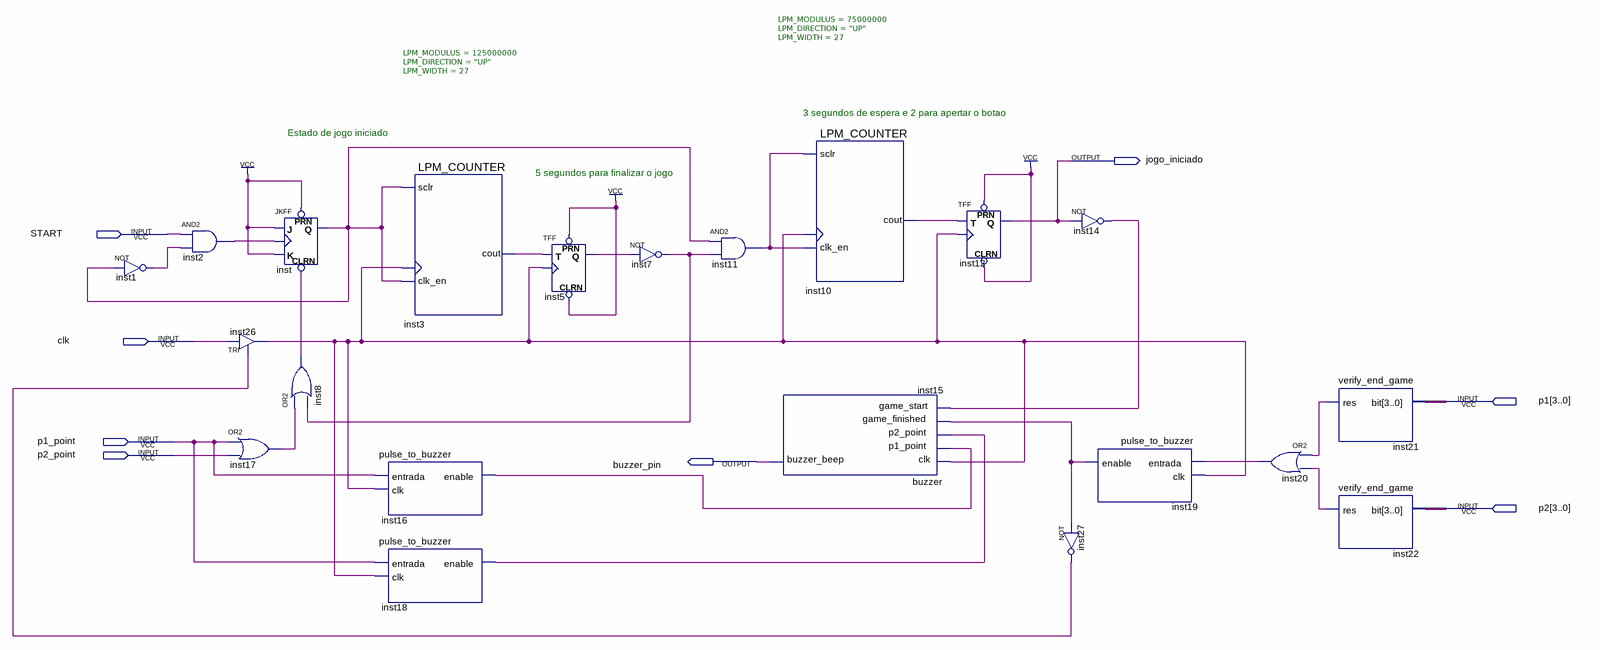
[diagram p0: schematic sheet]
// Quartus schematic game_control.bdf as structural Verilog: 21 symbols, 8 pins
module game_control (
  input  START,
  input  clk,
  input  [3:0] p1,
  input  p1_point,
  input  p2_point,
  input  [3:0] p2,
  output jogo_iniciado,
  output buzzer_pin
);

  wire inst1_out, inst2_out, inst3_cout, inst5_q, inst7_out, inst8_out, inst10_cout, inst11_out, inst14_out,
       inst16_enable, inst17_out, inst18_enable, inst19_enable, inst20_out, inst21_res, inst22_res,
       inst26_out, inst27_out, inst_q;

  not inst1 (inst1_out, inst_q);
  and inst2 (inst2_out, START, inst1_out);
  TRI inst26 (.IN(clk), .OE(inst27_out), .OUT(inst26_out));
  or inst17 (inst17_out, p1_point, p2_point);
  JKFF inst (.PRN(1'b1), .CLRN(inst8_out), .K(1'b1), .J(1'b1), .CLK(inst2_out), .Q(inst_q));
  or inst8 (inst8_out, inst17_out, inst7_out);
  LPM_COUNTER #(.LPM_MODULUS(125000000), .LPM_DIRECTION("UP"), .LPM_WIDTH(27)) inst3 (
    .clk_en(inst_q), .clock(inst26_out), .sclr(inst_q), .cout(inst3_cout));
  pulse_to_buzzer inst16 (.entrada(p1_point), .clk(inst26_out), .enable(inst16_enable));
  pulse_to_buzzer inst18 (.entrada(p1_point), .clk(inst26_out), .enable(inst18_enable));
  TFF inst5 (.PRN(1'b1), .CLRN(1'b1), .T(inst3_cout), .CLK(inst26_out), .Q(inst5_q));
  not inst7 (inst7_out, inst5_q);
  and inst11 (inst11_out, inst_q, inst7_out);
  buzzer inst15 (
    .clk(inst26_out), .p1_point(inst16_enable), .p2_point(inst18_enable), .game_finished(inst19_enable),
    .game_start(inst14_out), .buzzer_beep(buzzer_pin));
  LPM_COUNTER #(.LPM_MODULUS(75000000), .LPM_DIRECTION("UP"), .LPM_WIDTH(27)) inst10 (
    .clk_en(inst11_out), .clock(inst26_out), .sclr(inst11_out), .cout(inst10_cout));
  TFF inst12 (.PRN(1'b1), .CLRN(1'b1), .T(inst10_cout), .CLK(inst26_out), .Q(jogo_iniciado));
  not inst27 (inst27_out, inst19_enable);
  not inst14 (inst14_out, jogo_iniciado);
  pulse_to_buzzer inst19 (.entrada(inst20_out), .clk(inst26_out), .enable(inst19_enable));
  or inst20 (inst20_out, inst21_res, inst22_res);
  verify_end_game inst21 (.\bit (p1), .res(inst21_res));
  verify_end_game inst22 (.\bit (p2), .res(inst22_res));

  // Notes on the sheet:
  //   3 segundos de espera e 2 para apertar o botao
  //   Estado de jogo iniciado
  //   5 segundos para finalizar o jogo
endmodule
